# Altium schematic sheet Плата печатная А3.SchDoc
size 420 x 297 mm; Address1: Address1; Address2: Address2; Address3: Address3; Address4: Address4; SheetNumber: 1; Scale: 1:1; Разраб.: Павловская В.А.; Пров.: Смолин В.А.; Номер листа: 1; Общее количество листов: 5; Масштаб: 2:1
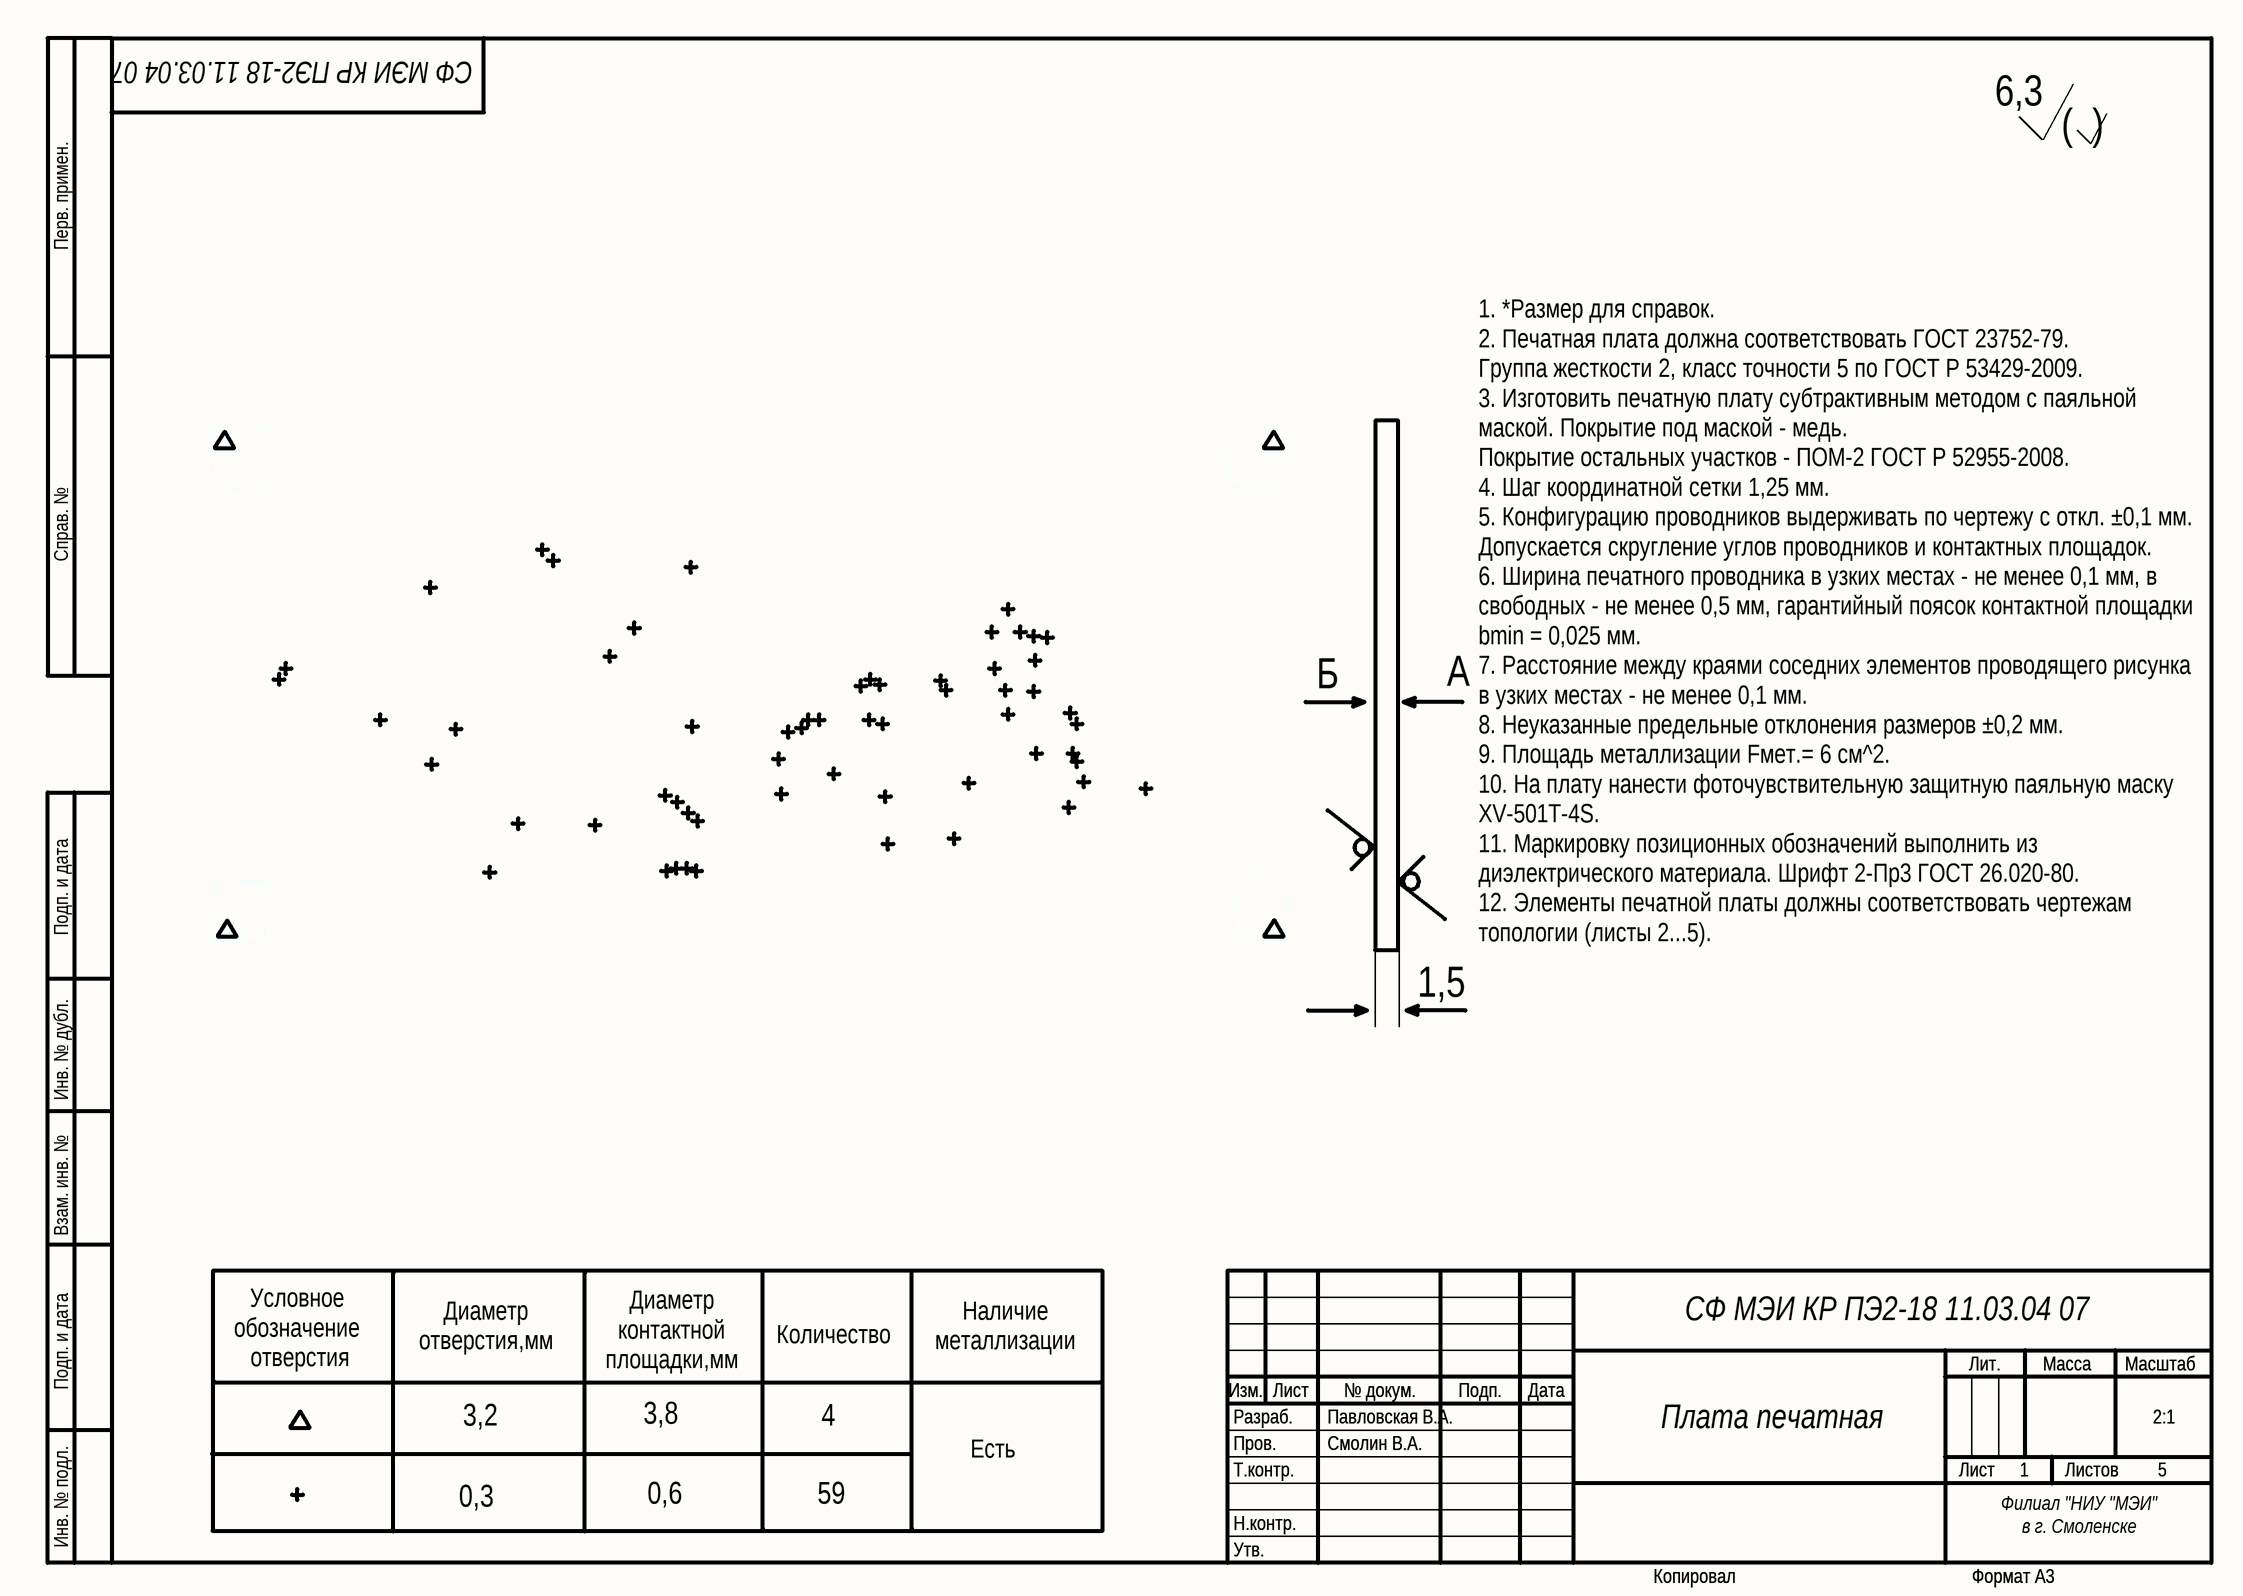
[diagram p0: Плата печатная А3.SchDoc]

## Notes on the sheet
- СФ МЭИ КР ПЭ2-18 11.03.04 07
- 6,3
- (  )
- Б
- А
- 1,5
- 1. *Размер для справок.
  2. Печатная плата должна соответствовать ГОСТ 23752-79.
  Группа жесткости 2, класс точности 5 по ГОСТ Р 53429-2009.
  3. Изготовить печатную плату субтрактивным методом с паяльной маской. Покрытие под маской - медь.
  Покрытие остальных участков - ПОМ-2 ГОСТ Р 52955-2008.
  4. Шаг координатной сетки 1,25 мм.
  5. Конфигурацию проводников выдерживать по чертежу с откл. ±0,1 мм.
  Допускается скругление углов проводников и контактных площадок.
  6. Ширина печатного проводника в узких местах - не менее 0,1 мм, в свободных - не менее 0,5 мм, гарантийный поясок контактной площадки bmin = 0,025 мм.
  7. Расстояние между краями соседних элементов проводящего рисунка в узких местах - не менее 0,1 мм.
  8. Неуказанные предельные отклонения размеров ±0,2 мм.
  9. Площадь металлизации Fмет.= 6 см^2.
  10. На плату нанести фоточувствительную защитную паяльную маску XV-501T-4S.
  11. Маркировку позиционных обозначений выполнить из диэлектрического материала. Шрифт 2-Пр3 ГОСТ 26.020-80.
  12. Элементы печатной платы должны соответствовать чертежам топологии (листы 2...5).
- Условное
  обозначение
  отверстия
- Диаметр
  отверстия,мм
- Диаметр
  контактной
  площадки,мм
- Количество
- Наличие
  металлизации
- Разраб.
- Изм.
- Лист
- № докум.
- Подп.
- Дата
- Плата печатная
- Лит.
- Масса
- Масштаб
- 3,2
- 3,8
- 4
- Есть
- Пров.
- Т.контр.
- Листов
- 0,3
- 0,6
- 59
- Утв.
- Н.контр.
- Филиал "НИУ "МЭИ"
  в г. Смоленске
  ПЭ2-18
- Копировал
- Формат А3
- Перв. примен.
- Справ. №
- Подп. и дата
- Инв. № дубл.
- Взам. инв. №
- Инв. № подл.